# EAGLE design LiPo Charger (EAGLE 6.1)
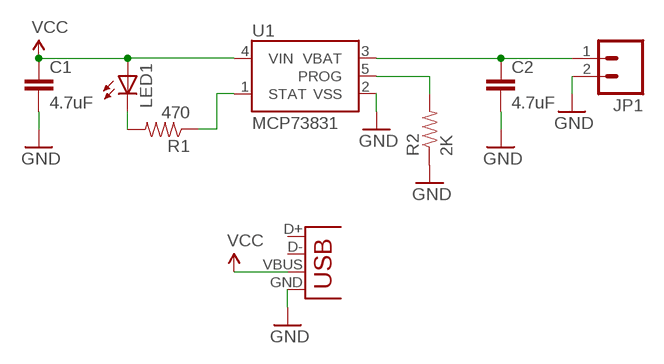
[diagram p0: schematic, sheet 1]

## Parts
C1  4.7uF  CAP1206  [1206]
C2  4.7uF  CAP1206  [1206]
JP1  M02POLAR  [MOLEX-1X2]
LED1  LEDCHIP-LED0603  [CHIP-LED0603]
R1  470  RESISTOR0805-RES  [0805]
R2  2K  RESISTOR0805-RES  [0805]
U1  MCP73831  [SOT23-5]
X1  USB  [USB-A-MALE-SMT]

## Nets
GND: C1.2 C2.2 JP1.2 R2.1 U1.2(VSS) X1.GND
N$1: LED1.C R1.2
N$3: R1.1 U1.1(STAT)
N$5: R2.2 U1.5(PROG)
VBAT: C2.1 JP1.1 U1.3(VBAT)
VCC: C1.1 LED1.A U1.4(VIN) X1.VBUS
Unconnected: X1.D+ X1.D-

## Library data of the parts
C1 C2 = SparkFun-Passives:CAP: Capacitor Standard 0603 ceramic capacitor, and 0.1" leaded capacitor.
JP1 = SparkFun-Connectors:M02: Header 2 Standard 2-pin 0.1" header. Use with straight break away headers (SKU : PRT-00116), right angle break away headers (PRT-00553), swiss pins (PRT-00743), machine pins (PRT-00117), and female headers (PRT-00115). Molex polarized connector foot print use with SKU : PRT-08233 with associated crimp pins and housings.
LED1 = led:LED: LED OSRAM: - CHIPLED LG R971, LG N971, LY N971, LG Q971, LY Q971, LO R971, LY R971 LH N974, LH R974 LS Q976, LO Q976, LY Q976 LO Q996 - Hyper CHIPLED LW Q18S LB Q993, LB Q99A, LB R99A - SideLED LS A670, LO A670, LY A670, LG A670, LP A670 LB A673, LV A673, LT A673, LW A673 LH A674 LY A675 LS A676, LA A676, LO A676, LY A676, LW A676 LS A679, LY A679, LG A679 - Hyper Micro SIDELED® LS Y876, LA Y876, LO Y876, LY Y876 LT Y87S - SmartLED LW L88C, LW L88S LB L89C, LB L89S, LG L890 LS L89K, LO L89K, LY L89K LS L896, LA L896, LO L896, LY L896 - TOPLED LS T670, LO T670, LY T670, LG T670, LP T670 LSG T670, LSP T670, LSY T670, LOP T670, LYG T670 LG T671, LOG T671, LSG T671 LB T673, LV T673, LT T673, LW T673 LH T674 LS T676, LA T676, LO T676, LY T676, LB T676, LH T676, LSB T676, LW T676 LB T67C, LV T67C, LT T67C, LS T67K, LO T67K, LY T67K, LW E67C LS E67B, LA E67B, LO E67B, LY E67B, LB E67C, LV E67C, LT E67C LW T67C LS T679, LY T679, LG T679 LS T770, LO T770, LY T770, LG T770, LP T770 LB T773, LV T773, LT T773, LW T773 LH T774 LS E675, LA E675, LY E675, LS T675 LS T776, LA T776, LO T776, LY T776, LB T776 LHGB T686 LT T68C, LB T68C - Hyper Mini TOPLED® LB M676 - Mini TOPLED Santana® LG M470 LS M47K, LO M47K, LY M47K Source: http://www.osram.convergy.de LUXEON: - LUMILED® LXK2-PW12-R00, LXK2-PW12-S00, LXK2-PW14-U00, LXK2-PW14-V00 LXK2-PM12-R00, LXK2-PM12-S00, LXK2-PM14-U00 LXK2-PE12-Q00, LXK2-PE12-R00, LXK2-PE12-S00, LXK2-PE14-T00, LXK2-PE14-U00 LXK2-PB12-K00, LXK2-PB12-L00, LXK2-PB12-M00, LXK2-PB14-N00, LXK2-PB14-P00, LXK2-PB14-Q00 LXK2-PR12-L00, LXK2-PR12-M00, LXK2-PR14-Q00, LXK2-PR14-R00 LXK2-PD12-Q00, LXK2-PD12-R00, LXK2-PD12-S00 LXK2-PH12-R00, LXK2-PH12-S00 LXK2-PL12-P00, LXK2-PL12-Q00, LXK2-PL12-R00 Source: www.luxeon.com KINGBRIGHT: KA-3528ASYC Source: www.kingbright.com
R1 R2 = SparkFun-Passives:RESISTOR: Resistor Basic schematic elements and footprints for 0603, 1206, and PTH resistors.
U1 = SparkFun-PowerIC:MCP73831: Miniature single cell, fully integrated Li-Ion, Li-polymer charge management controller http://ww1.microchip.com/downloads/en/DeviceDoc/21984a.pdf
X1 = SparkFun-Connectors:USB: USB Connectors USB-B-PTH is fully proven SKU : PRT-00139 USB-miniB is fully proven SKU : PRT-00587 USB-A-PCB is untested. USB-A-H is throughly reviewed, but untested. Spark Fun Electronics SKU : PRT-00437 USB-B-SMT is throughly reviewed, but untested. Needs silkscreen touching up. USB-A-S has not been used/tested USB-MB-H has not been used/tested

## Board
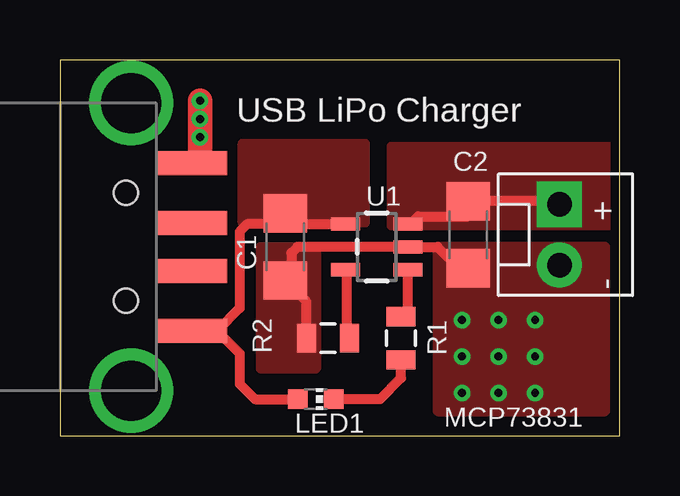
[diagram p1: board, top side]
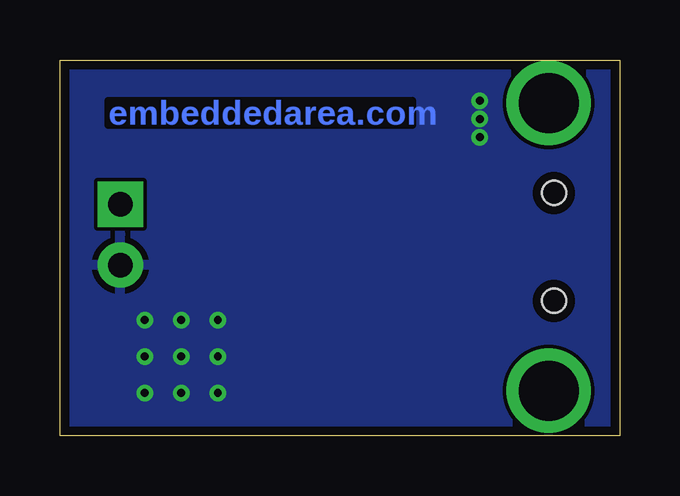
[diagram p2: board, bottom side, seen from below]

Size 23.35 x 15.67 mm. Coordinates in mm from the lower left corner, seen from the top.
Outline: 0,0 23.35,0 23.35,15.67 0,15.67 0,0
Copper layers (1*16): Top 0.0356mm / dielectric 1.5011mm / Bottom 0.0356mm
Design rules "LaenPCBOrder": minimum track width 6mil, minimum drill 13mil, track to track 6mil, track to pad 6mil, pad to pad 6mil, via to via 6mil, smd to smd 6mil, copper to edge 15mil, drill to drill 6mil, minimum pad ring 7mil, minimum via ring 7mil, stop-mask expansion 4mil, vias tented up to drill 13mil, thermal gap 10mil

### Footprints (pad centres in the part's own frame; a part is rotated, then mirrored left to right if it is on the bottom)
1206 = smd 1.6 x 1.8: 1 -1.4,0; 2 1.4,0
MOLEX-1X2 = drill 1.016 pad 1.88 square: 1 0,0 | drill 1.016 pad 1.88: 2 2.54,0
CHIP-LED0603 = smd 0.8 x 0.8: A 0,-0.75; C 0,0.75
0805 = smd 0.8 x 1.2: 1 -0.9,0; 2 0.9,0
SOT23-5 = smd 0.55 x 1.2: 1 -0.95,-1.3; 2 0,-1.3; 3 0.95,-1.3; 4 0.95,1.3; 5 -0.95,1.3
USB-A-MALE-SMT = smd 3 x 1: D+ 5.47,1; D- 5.47,-1; GND 5.47,3.5; VBUS 5.47,-3.5 | drill 2.5 pad 3: P$1 2.97,-6; P$2 2.97,6 | hole 1: 2.75,-2.25; 2.75,2.25

### Placement (x,y rotation side)
C1  9.4,7.87 270 top
C2  17.02,8.38 270 top
JP1  20.83,9.65 270 top
LED1  10.67,1.52 270 top
R1  14.22,4.06 270 top
R2  11.18,4.06 0 top
U1  13.21,7.87 90 top
X1  0,7.87 0 top

### Tracks (layer width: path | path; a pad name or v marks a point on that pad's centre or on a via)
GND  (via drill 0.33)
  Top 0.406: 17.39,6.6 C2.2 16.65,6.97 15.75,7.87 U1.2 9.91,7.87 9.65,7.62 9.65,6.86 9.4,6.6 | 9.77,6.97 C1.2 10.28,5.6 R2.1 | X1.GND 5.53,11.37
  Top 0.813: X1.GND 5.84,11.37
  Top 1.016: 5.84,11.37 v5.84,13.97
  other vias: 5.84,12.45 16.76,4.83 16.76,3.3 18.29,3.3 18.29,4.83 19.81,4.83 19.81,3.3 16.76,1.78 18.29,1.78 19.81,1.78 5.84,13.21
  pour Top (no thermals): 15.75,7.87 15.75,1.02 22.73,1.02 22.73,7.87
  pour Top (no thermals): 10.67,7.87 10.67,2.79 8.38,2.79 8.38,7.62 8.38,7.87
  pour Bottom: 0,0.51 0,16 24.64,15.75 24.64,0.25
N$1
  Top 0.406: LED1.C 13.35,1.52 14.22,2.4 R1.2
N$3
  Top 0.406: R1.1 14.51,4.96 U1.1
N$5
  Top 0.406: U1.5 11.94,6.92 11.94,4.06 R2.2
VBAT
  Top 0.406: U1.3 14.56,8.77 14.93,9.14 17.02,9.14 C2.1 20.7,9.78 JP1.1
  pour Top (no thermals): 13.84,8.76 13.84,12.06 22.99,12.06 22.99,8.76
VCC
  Top 0.406: LED1.A 8.13,1.52 7.49,2.16 7.49,3.43 6.55,4.37 | C1.1 9.45,8.82 | 9.45,8.82 U1.4 | 9.45,8.82 9.13,9.14 | 6.53,4.37 X1.VBUS 6.55,4.37 | 9.45,8.82 7.81,8.82 7.49,8.51 7.49,5.32 6.55,4.37
  pour Top (no thermals): 12.7,8.89 7.62,8.89 7.62,12.19 12.7,12.19

### Text on the board
Bottom: embeddedarea.com
tNames: USB LiPo Charger | + | - | MCP73831